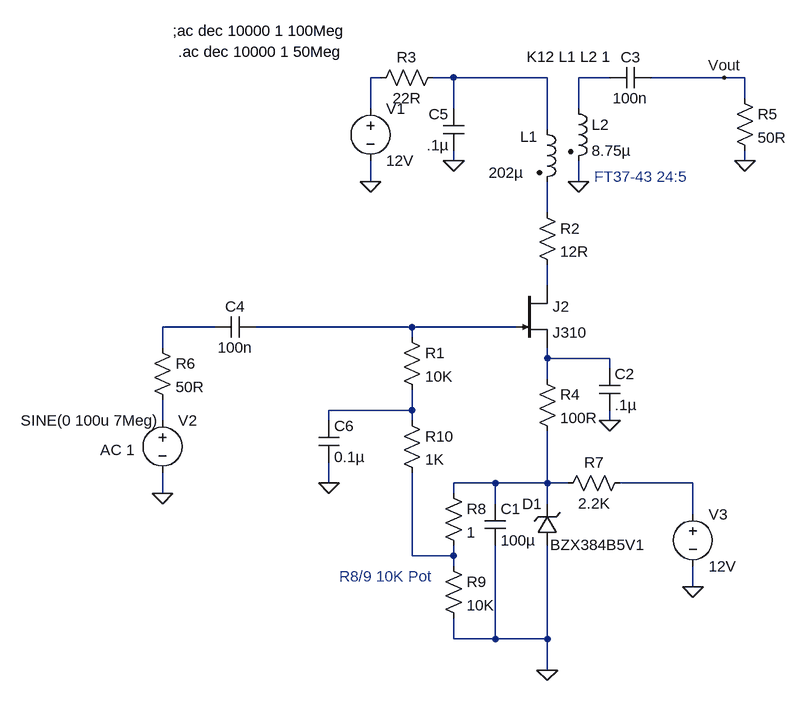
[diagram p0: schematic J310 RF AMP (EMRFD) - not working.asc]
J310 RF AMP (EMRFD) - not working.asc, the LTspice schematic file:
Version 4
SHEET 1 980 788
WIRE 16 -144 0 -144
WIRE 128 -144 96 -144
WIRE 272 -144 128 -144
WIRE 368 -144 320 -144
WIRE 544 -144 432 -144
WIRE 576 -144 544 -144
WIRE 576 -112 576 -144
WIRE 0 -96 0 -144
WIRE 128 -96 128 -144
WIRE 320 -96 320 -144
WIRE 272 -64 272 -144
WIRE 128 -16 128 -32
WIRE 576 -16 576 -32
WIRE 0 16 0 -16
WIRE 320 16 320 -16
WIRE 272 64 272 16
WIRE 272 176 272 144
WIRE -240 240 -320 240
WIRE 64 240 -176 240
WIRE 224 240 64 240
WIRE 64 256 64 240
WIRE -320 272 -320 240
WIRE 272 288 272 272
WIRE 368 288 272 288
WIRE 368 304 368 288
WIRE 272 320 272 288
WIRE 64 368 64 336
WIRE 64 368 -64 368
WIRE -320 384 -320 352
WIRE -64 384 -64 368
WIRE 64 384 64 368
WIRE 368 384 368 368
WIRE -64 480 -64 448
WIRE 192 480 128 480
WIRE 272 480 272 400
WIRE 272 480 192 480
WIRE 304 480 272 480
WIRE 496 480 384 480
WIRE -320 496 -320 464
WIRE 128 496 128 480
WIRE 192 512 192 480
WIRE 272 512 272 480
WIRE 496 528 496 480
WIRE 64 592 64 464
WIRE 128 592 128 576
WIRE 128 592 64 592
WIRE 128 608 128 592
WIRE 496 640 496 608
WIRE 128 720 128 688
WIRE 192 720 192 576
WIRE 192 720 128 720
WIRE 272 720 272 576
WIRE 272 720 192 720
WIRE 272 768 272 720
FLAG 128 -16 0
FLAG 0 16 0
FLAG 320 16 0
FLAG 576 -16 0
FLAG 544 -144 Vout
FLAG 368 384 0
FLAG 496 640 0
FLAG 272 768 0
FLAG -64 480 0
FLAG -320 496 0
SYMBOL voltage 0 -112 R0
WINDOW 123 0 0 Left 2
WINDOW 39 0 0 Left 2
SYMATTR InstName V1
SYMATTR Value 12V
SYMBOL voltage -320 368 R0
WINDOW 3 -218 16 Left 2
WINDOW 123 -96 61 Left 2
WINDOW 39 0 0 Left 2
SYMATTR Value SINE(0 100u 7Meg)
SYMATTR Value2 AC 1
SYMATTR InstName V2
SYMBOL ind2 256 -80 R0
WINDOW 0 -26 27 Left 2
WINDOW 3 -74 82 Left 2
SYMATTR InstName L1
SYMATTR Value 202µ
SYMATTR Type ind
SYMBOL ind2 304 -112 R0
SYMATTR InstName L2
SYMATTR Value 8.75µ
SYMATTR Type ind
SYMBOL res 48 240 R0
SYMATTR InstName R1
SYMATTR Value 10K
SYMBOL res 256 304 R0
SYMATTR InstName R4
SYMATTR Value 100R
SYMBOL res 560 -128 R0
SYMATTR InstName R5
SYMATTR Value 50R
SYMBOL cap 352 304 R0
SYMATTR InstName C2
SYMATTR Value .1µ
SYMBOL cap 432 -160 R90
WINDOW 0 0 32 VBottom 2
WINDOW 3 32 32 VTop 2
SYMATTR InstName C3
SYMATTR Value 100n
SYMBOL cap -176 224 R90
WINDOW 0 0 32 VBottom 2
WINDOW 3 32 32 VTop 2
SYMATTR InstName C4
SYMATTR Value 100n
SYMBOL cap 144 -32 R180
WINDOW 0 24 56 Left 2
WINDOW 3 24 8 Left 2
SYMATTR InstName C5
SYMATTR Value .1µ
SYMBOL res -336 256 R0
SYMATTR InstName R6
SYMATTR Value 50R
SYMBOL njf 224 176 R0
SYMATTR InstName J2
SYMATTR Value J310
SYMBOL res 256 48 R0
SYMATTR InstName R2
SYMATTR Value 12R
SYMBOL res 112 -160 R90
WINDOW 0 0 56 VBottom 2
WINDOW 3 32 56 VTop 2
SYMATTR InstName R3
SYMATTR Value 22R
SYMBOL voltage 496 512 R0
WINDOW 123 0 0 Left 2
WINDOW 39 0 0 Left 2
SYMATTR InstName V3
SYMATTR Value 12V
SYMBOL res 400 464 R90
WINDOW 0 0 56 VBottom 2
WINDOW 3 32 56 VTop 2
SYMATTR InstName R7
SYMATTR Value 2.2K
SYMBOL zener 288 576 R180
WINDOW 0 24 64 Left 2
WINDOW 3 -134 1 Left 2
SYMATTR InstName D1
SYMATTR Value BZX384B5V1
SYMATTR Description Diode
SYMATTR Type diode
SYMBOL cap 176 512 R0
SYMATTR InstName C1
SYMATTR Value 100µ
SYMBOL res 112 480 R0
SYMATTR InstName R8
SYMATTR Value 1
SYMBOL res 112 592 R0
SYMATTR InstName R9
SYMATTR Value 10K
SYMBOL cap -80 384 R0
SYMATTR InstName C6
SYMATTR Value 0.1µ
SYMBOL res 48 368 R0
SYMATTR InstName R10
SYMATTR Value 1K
TEXT 240 -176 Left 2 !K12 L1 L2 1
TEXT -296 -184 Left 2 !.ac dec 10000 1 50Meg
TEXT -304 -216 Left 2 !;ac dec 10000 1 100Meg
TEXT -48 624 Left 2 ;R8/9 10K Pot
TEXT 344 8 Left 2 ;FT37-43 24:5

The netlist it stands for:
* J310 RF AMP (EMRFD) - not working.asc
V1 N001 0 12V
V2 N010 0 SINE(0 100u 7Meg) AC 1
L1 N002 N004 202µ
L2 N003 0 8.75µ
R1 N007 N009 10K
R4 N008 N011 100R
R5 Vout 0 50R
C2 N008 0 .1µ
C3 Vout N003 100n
C4 N007 N006 100n
C5 0 N002 .1µ
R6 N006 N010 50R
J2 N005 N007 N008 J310
R2 N004 N005 12R
R3 N002 N001 22R
V3 N012 0 12V
R7 N012 N011 2.2K
D1 0 N011 BZX384B5V1
C1 N011 0 100µ
R8 N011 N013 1
R9 N013 0 10K
C6 N009 0 0.1µ
R10 N009 N013 1K
.model D D
.lib standard.dio
.model NJF NJF
.model PJF PJF
.lib standard.jft
K12 L1 L2 1
.ac dec 10000 1 50Meg
;ac dec 10000 1 100Meg
* R8/9 10K Pot
* FT37-43 24:5
.backanno
.end